# Altium schematic sheet Isolated_DCDC.SchDoc
size A3; SheetNumber: 4; SheetTotal: 9
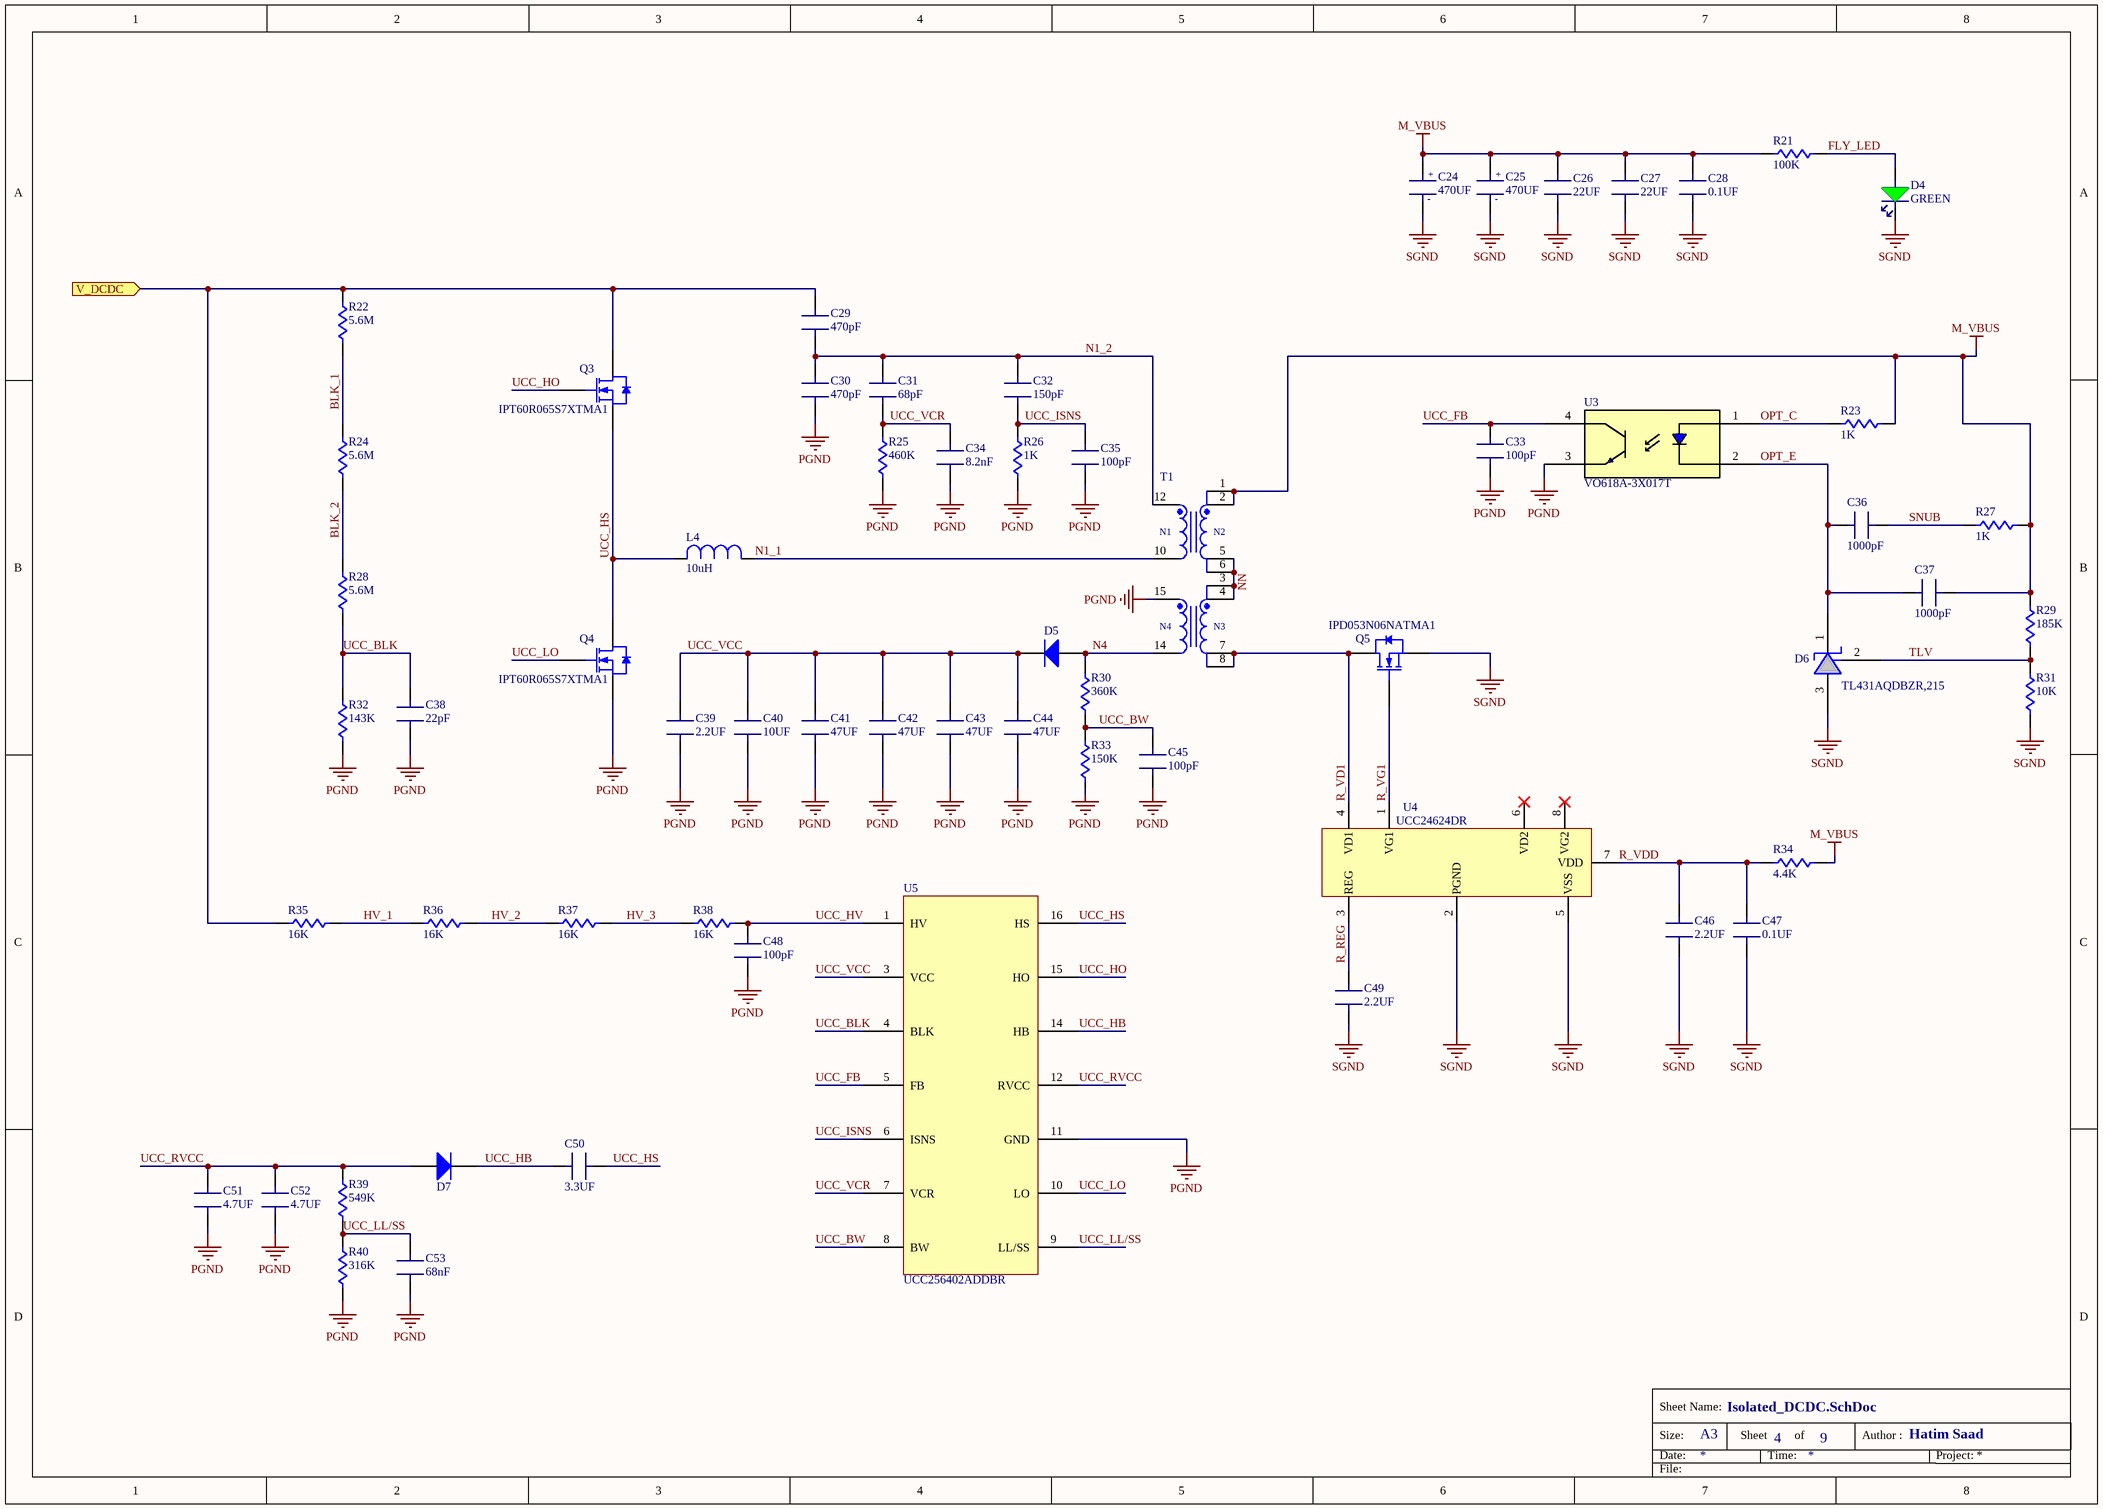
[diagram p0: Isolated_DCDC.SchDoc]

## Parts
C24  470UF  [CAP: D16C7.5H25]
C25  470UF  [CAP: D16C7.5H25]
C26  22UF  [CAP: 0805]
C27  22UF  [CAP: 0805]
C28  0.1UF  [CAP: 0603]
C29  470pF  [CAP: 1206]
C30  470pF  [CAP: 1206]
C31  68pF  [CAP: 1206]
C32  150pF  [CAP: 1206]
C33  100pF  [CAP: 0603]
C34  8.2nF  [CAP: 0603]
C35  100pF  [CAP: 0603]
C36  1000pF  [CAP: 0603]
C37  1000pF  [CAP: 0603]
C38  22pF  [CAP: 0603]
C39  2.2UF  [CAP: 0603]
C40  10UF  [CAP: 0805]
C41  47UF  [CAP: 1206]
C42  47UF  [CAP: 1206]
C43  47UF  [CAP: 1206]
C44  47UF  [CAP: 1206]
C45  100pF  [CAP: 0603]
C46  2.2UF  [CAP: 0603]
C47  0.1UF  [CAP: 0603]
C48  100pF  [CAP: 1206]
C49  2.2UF  [CAP: 0603]
C50  3.3UF  [CAP: 1206]
C51  4.7UF  [CAP: 0603]
C52  4.7UF  [CAP: 0603]
C53  68nF  [CAP: 0603]
D4  GREEN  [LED: 0603G]
D5  V1PM15-M3/H  [DO-219AD-2]  (value not drawn)
D6  TL431AQDBZR,215  [SOT23(TO-236AB)_NEX]
D7  V1PM15-M3/H  [DO-219AD-2]  (value not drawn)
L4  10uH  [IND: PQ2614BLA100K]
Q3  IPT60R065S7XTMA1  [8-HSOF]
Q4  IPT60R065S7XTMA1  [8-HSOF]
Q5  IPD053N06NATMA1  [DPAK_3]
R21  100K  [RES: 0603]
R22  5.6M  [RES: 2512]
R23  1K  [RES: 0603]
R24  5.6M  [RES: 2512]
R25  460K  [RES: 0603]
R26  1K  [RES: 0603]
R27  1K  [RES: 0603]
R28  5.6M  [RES: 2512]
R29  185K  [RES: 0603]
R30  360K  [RES: 0603]
R31  10K  [RES: 0603]
R32  143K  [RES: 0603]
R33  150K  [RES: 0603]
R34  4.4K  [RES: 0603]
R35  16K  [RES: 2512]
R36  16K  [RES: 2512]
R37  16K  [RES: 2512]
R38  16K  [RES: 2512]
R39  549K  [RES: 1206]
R40  316K  [RES: 0603]
T1  360-400Vin, 24Vout, 250W  [WE-LLCR_ETD44]  (value not drawn)
U3  VO618A-3X017T  [4-SMD_2]
U4  UCC24624DR  [8-SOIC]
U5  UCC256402ADDBR  [14-SOIC (DDB)]

## Ports
V_DCDC (in)

## Nets
M_VBUS: C24.1(+) C25.1(+) C26.2(B) C27.2(B) C28.2(B) C37.1(A) R21.2 R23.1 R27.1 R29.1 R34.2 T1.1 T1.2
PGND: C30.1(A) C33.1(A) C34.1(A) C35.1(A) C38.1(A) C39.1(A) C40.1(A) C41.1(A) C42.1(A) C43.1(A) C44.1(A) C45.1(A) C48.1(A) C51.1(A) C52.1(A) C53.1(A) Q4.3(S) R25.1 R26.1 R32.1 R33.1 R40.1 T1.15 U3.3(E) U5.11(GND)
SGND: C24.2(-) C25.2(-) C26.1(A) C27.1(A) C28.1(A) C46.1(A) C47.1(A) C49.1(A) D4.1(C) D6.3 Q5.3(S) R31.2 U4.2(PGND) U4.5(VSS)
BLK_1: R22.1 R24.2
BLK_2: R24.1 R28.2
FLY_LED: D4.2(A) R21.1
HV_1: R35.2 R36.1
HV_2: R36.2 R37.1
HV_3: R37.2 R38.1
N1_1: L4.1 T1.10
N1_2: C29.1(A) C30.2(B) C31.2(B) C32.2(B) T1.12
N4: D5.2(A) R30.2 T1.14
NN: T1.3 T1.4 T1.5 T1.6
OPT_C: R23.2 U3.1(A)
OPT_E: C36.2(B) C37.2(B) D6.1 U3.2(C)
R_REG: C49.2(B) U4.3(REG)
R_VD1: Q5.4(D) T1.7 T1.8 U4.4(VD1)
R_VDD: C46.2(B) C47.2(B) R34.1 U4.7(VDD)
R_VG1: Q5.1(G) U4.1(VG1)
SNUB: C36.1(A) R27.2
TLV: D6.2 R29.2 R31.1
UCC_BLK: C38.2(B) R28.1 R32.2 U5.4(BLK)
UCC_BW: C45.2(B) R30.1 R33.2 U5.8(BW)
UCC_FB: C33.2(B) U3.4(C) U5.5(FB)
UCC_HB: C50.2(B) D7.1(K) U5.14(HB)
UCC_HO: Q3.1(G) U5.15(HO)
UCC_HS: C50.1(A) L4.2 Q3.3(S) Q4.2(D) U5.16(HS)
UCC_HV: C48.2(B) R38.2 U5.1(HV)
UCC_ISNS: C32.1(A) C35.2(B) R26.2 U5.6(ISNS)
UCC_LL/SS: C53.2(B) R39.1 R40.2 U5.9(LL/SS)
UCC_LO: Q4.1(G) U5.10(LO)
UCC_RVCC: C51.2(B) C52.2(B) D7.2(A) R39.2 U5.12(RVCC)
UCC_VCC: C39.2(B) C40.2(B) C41.2(B) C42.2(B) C43.2(B) C44.2(B) D5.1(K) U5.3(VCC)
UCC_VCR: C31.1(A) C34.2(B) R25.2 U5.7(VCR)
V_DCDC: C29.2(B) Q3.2(D) R22.2 R35.1 ; port V_DCDC

Not connected (* = marked no-connect by the designer): U4 6(VD2)* 8(VG2)*

## Notes on the sheet
- Size:
- Date:
- Sheet Name:
- A3
- Sheet
- Time:
- of
- Author :
- Hatim Saad
- Project:
- File:
- (in symbol 760895741) N1; N2; N4; N3

## Library data of the parts
C24 C25 = ESK477M100AM7AA: Aluminium Electrolytic Capacitors - Radial Leaded 100V 470uF 85C 2k Hour Radial; Supplier 1: Mouser; Supplier Part Number 1: 80-ESK477M100AM7AA
C26 C27 C40 = CAP 0805: CAP SMD 0805
C28 C33-C39 C45-C47 C49 C51-C53 = CAP 0603: CAP SMD 0603
C29-C32 C41-C44 C50 = CAP 1206: CAP SMD 1206
C48 = VJ1206A101JXGCW1HV: Multilayer Ceramic Capacitors MLCC - SMD/SMT 1206 100pF 5 % 1000V NP0; Supplier 1: Mouser; Supplier Part Number 1: 77-VJ1206A101JXGAT5Z
D4 = LED GREEN 0603: LED GREEN CLEAR 0603 SMD
D5 D7 = V1PM15-M3/H: Schottky Diodes & Rectifiers 150V 1A TMBS MicroSMP; Supplier 1: Mouser; Supplier Part Number 1: 78-V1PM15-M3/H
D6 = TL431AQDBZR,215: Shunt Voltage Reference IC Adjustable 2.495V 36 VV ±1% 100 mA TO-236AB; Supplier 1: Mouser; Supplier Part Number 1: 771-TL431AQDBZR215
L4 = PQ2614BLA-100K: Power Inductors - SMD 10uH 10% 30A AEC-Q200 GULL WING; Supplier 1: Mouser; Supplier Part Number 1: 652-PQ2614BLA-100K
Q3 Q4 = IPT60R065S7XTMA1: MOSFET N-CH 600V 8A 8HSOF; Supplier 1: Mouser; Supplier Part Number 1: 726-IPT60R065S7XTMA1
Q5 = IPD053N06NATMA1: MOSFETs N-Ch 60V 45A DPAK-2; Supplier 1: Mouser; Supplier Part Number 1: 726-IPD053N06NATMA1
R21 R23 R25-R27 R29-R34 R40 = RES 0603: RES SMD 0603
R22 R24 R28 = RES 2512: RES SMD 2512
R35-R38 = CRCW251216K9FKEG: Thick Film Resistors CRCW2512 100 16K9 1% E67 e3; Supplier 1: Mouser; Supplier Part Number 1: 71-CRCW251216K9FKEG
R39 = RES 1206: RES SMD 1206
T1 = 760895741: WE-LLCR Resonant Converter, THT, ETD44, 360-400Vin, 24Vout, 250W; Manufacturer: Wurth Elektronik; Auxiliary Voltage: 16V; Inductance: 400uH; Leakage Inductance: 65uH; Output Current: 10.4A; Output Voltage: 24V; Saturation Current: 4.3A; Switching Frequency: 70-120kHz; Turns Ratio: 27:3:3:2; Manufacturer Part Number: 760895741; Category: Transformers For AC-DC Converter; Match Code: WE-LLCR; ComponentLink1Description: Website Link; ComponentLink1URL: https://www.we-online.com/redexpert/article/760895741?ad; ComponentLink2Description: Datasheet Link; ComponentLink2URL: https://www.we-online.com/redexpert/spec/760895741?ad; Mount: Through Hole; Operating Temperature Max: 125°C; Operating Temperature Min: -40°C; Packaging: Tray; Case/Size Code: ETD44; Length: 48mm; Width: 46mm; Height: 27.5mm; Input Voltage: 360-400V; Output Power: 250W
U3 = VO618A-3X017T: Transistor Output Optocouplers Phototransistor Out CTR 100-200%; Supplier 1: Mouser; Supplier Part Number 1: 78-VO618A-3X017T
U4 = UCC24624DR: Gate Drivers High-frequency dual synchronous rectifi A 595-UCC24624DT; Supplier 1: Mouser; Supplier Part Number 1: 595-UCC24624DR
U5 = UCC256402ADDBR: Switching Controllers LLC resonant control ler with ultra-low s A 595-UCC256402ADDBT; Supplier 1: Mouser; Supplier Part Number 1: 595-UCC256402ADDBR